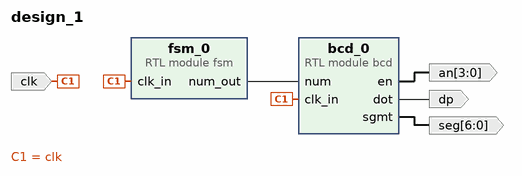
[diagram p0: block diagram of the top level]
# Vivado block design design_1, xc7a35tcpg236-1, Vivado 2024.2
create_bd_design design_1

create_bd_port -dir I clk
create_bd_port -dir O -from 6 -to 0 seg
create_bd_port -dir O -from 3 -to 0 an
create_bd_port -dir O dp

create_bd_cell -type module -reference bcd bcd_0
create_bd_cell -type module -reference fsm fsm_0

# ---- connections ----

connect_bd_net [get_bd_pins bcd_0/dot] [get_bd_ports dp]
connect_bd_net [get_bd_pins bcd_0/en] [get_bd_ports an]
connect_bd_net [get_bd_pins bcd_0/sgmt] [get_bd_ports seg]
connect_bd_net [get_bd_ports clk] [get_bd_pins bcd_0/clk_in] [get_bd_pins fsm_0/clk_in]
connect_bd_net -net fsm_0_num [get_bd_pins fsm_0/num_out] [get_bd_pins bcd_0/num]

validate_bd_design
save_bd_design
